# EAGLE schematic CEM3340 VCO (EAGLE 7.4.0)
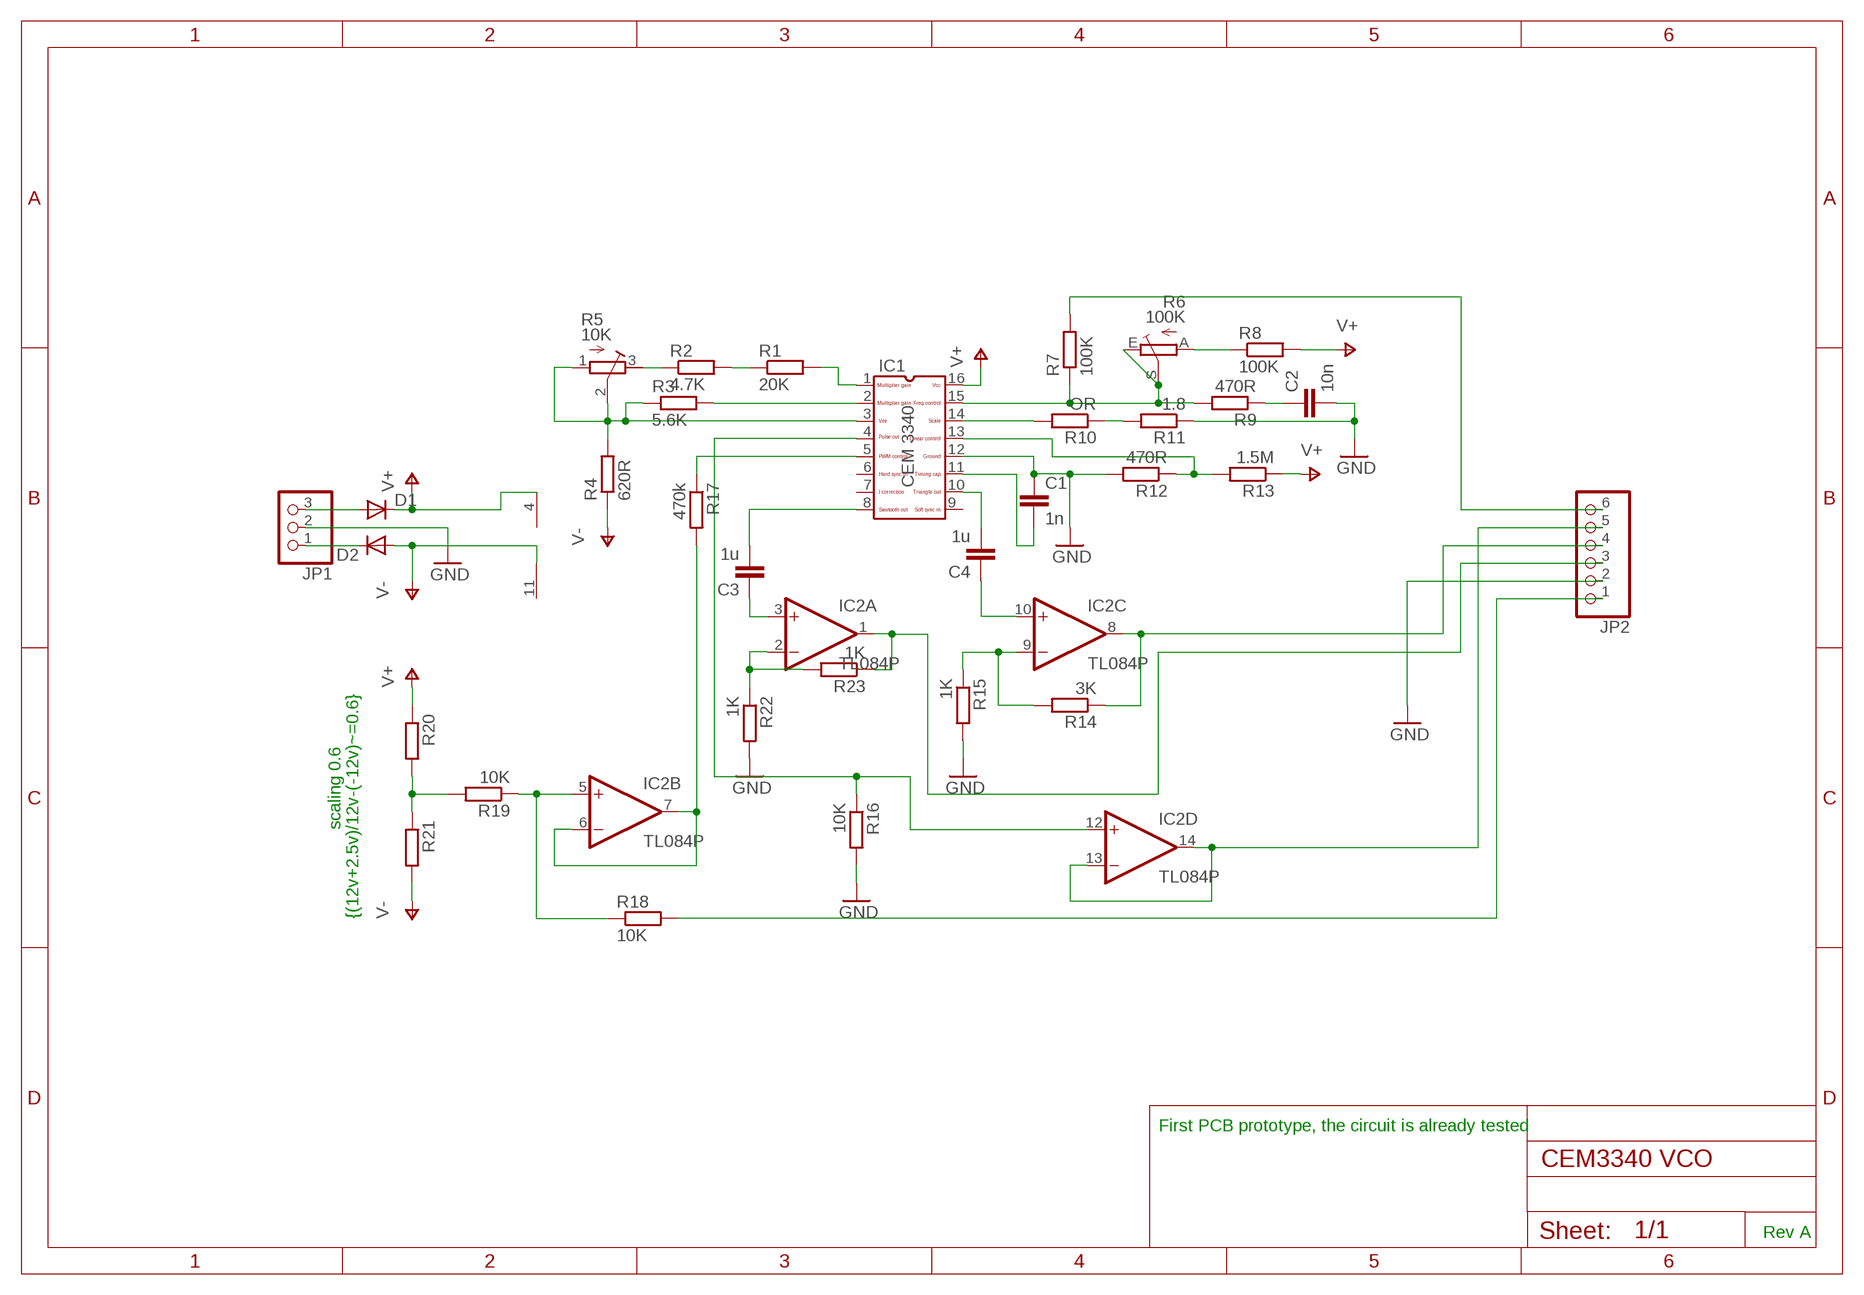
[diagram p0: schematic, sheet 1]

## Parts
C1  1n  C-EU050-025X075  [C050-025X075]
C2  10n  C-EU050-025X075  [C050-025X075]
C3  1u  C-EU050-025X075  [C050-025X075]
C4  1u  C-EU050-025X075  [C050-025X075]
D1  DIODE-D-2.5  [D-2.5]
D2  DIODE-D-2.5  [D-2.5]
IC1  CEM3340  [DIL16]
IC2  TL084P  [DIL14]
JP1  PINHD-1X3  [1X03]
JP2  PINHD-1X6  [1X06]
R1  20K  R-EU_0204/2V  [0204V]
R2  4.7K  R-EU_0204/2V  [0204V]
R3  5.6K  R-EU_0204/2V  [0204V]
R4  620R  R-EU_0204/2V  [0204V]
R5  10K  R-TRIMM64W  [RTRIM64W]
R6  100K  TRIM_EU-CA6V  [CA6V]
R7  100K  R-EU_0204/2V  [0204V]
R8  100K  R-EU_0204/2V  [0204V]
R9  470R  R-EU_0204/2V  [0204V]
R10  OR  R-EU_0204/2V  [0204V]
R11  1.8  R-EU_0204/2V  [0204V]
R12  470R  R-EU_0204/2V  [0204V]
R13  1.5M  R-EU_0204/7  [0204/7]
R14  3K  R-EU_0204/2V  [0204V]
R15  1K  R-EU_0204/5  [0204/5]
R16  10K  R-EU_0204/5  [0204/5]
R17  470k  R-EU_0204/7  [0204/7]
R18  10K  R-EU_0204/2V  [0204V]
R19  10K  R-EU_0204/5  [0204/5]
R20  R-EU_0204/5  [0204/5]
R21  R-EU_0204/2V  [0204V]
R22  1K  R-EU_0204/5  [0204/5]
R23  1K  R-EU_0204/2V  [0204V]

## Nets
GND: C1.1 C2.2 IC1.12 JP1.2 JP2.2 R11.1 R12.2 R15.2 R16.2 R22.2
N$1: IC1.1 R1.2
N$2: R1.1 R2.2
N$3: R2.1 R5.3(E)
N$4: IC1.3 R3.1 R4.2 R5.1(A) R5.2(S)
N$5: IC1.14 R10.2
N$6: IC1.2 R3.2
N$7: R10.1 R11.2
N$8: IC1.13 R12.1 R13.2
N$9: JP2.6 R7.2
N$10: C1.2 IC1.11
N$11: IC2.1(A:OUT) JP2.3 R23.1
N$12: C3.2 IC1.8
N$13: R6.A R8.1
N$14: IC1.5 R17.1
N$15: IC1.15 R6.E R6.S R7.1 R9.2
N$16: C2.1 R9.1
N$17: IC2.9(C:-IN) R14.2 R15.1
N$18: IC2.8(C:OUT) JP2.4 R14.1
N$19: C4.1 IC2.10(C:+IN)
N$20: IC2.13(D:-IN) IC2.14(D:OUT) JP2.5
N$21: JP2.1 R18.2
N$22: IC1.4 IC2.12(D:+IN) R16.1
N$23: IC2.6(B:-IN) IC2.7(B:OUT) R17.2
N$24: R19.2 R20.2 R21.1
N$25: IC2.5(B:+IN) R18.1 R19.1
N$26: C4.2 IC1.10
N$27: C3.1 IC2.3(A:+IN)
N$28: IC2.2(A:-IN) R22.1 R23.2
N$30: D1.A JP1.3
N$33: D2.C JP1.1
V+: D1.C IC1.16 IC2.4(P:V+) R8.2 R13.1 R20.1
V-: D2.A R4.1 R21.2
Unconnected: IC1.6 IC1.7 IC1.9

## Notes on the sheet
- scaling 0.6
- {(12v+2.5v)/12v-(-12v)~=0.6}
- First PCB prototype, the circuit is already tested
- Rev A

## Power pins joined to a net without a drawn wire
V-: IC2.11(P:V-)

## Library data of the parts
C1-C4 = resistor:C-EU: CAPACITOR, European symbol
D1 D2 = diode:DIODE-: DIODE
IC1 = CEM:CEM3340: CEM 3340 VCO
IC2 = linear:TL084: OP AMP
JP1 = adafruit:PINHD-1X3: PIN HEADER
JP2 = pinhead:PINHD-1X6: PIN HEADER
R1-R4 R7-R23 = resistor:R-EU_: RESISTOR, European symbol
R5 = rcl:R-TRIMM: Trimm resistor
R6 = pot:TRIM_EU-: POTENTIOMETER